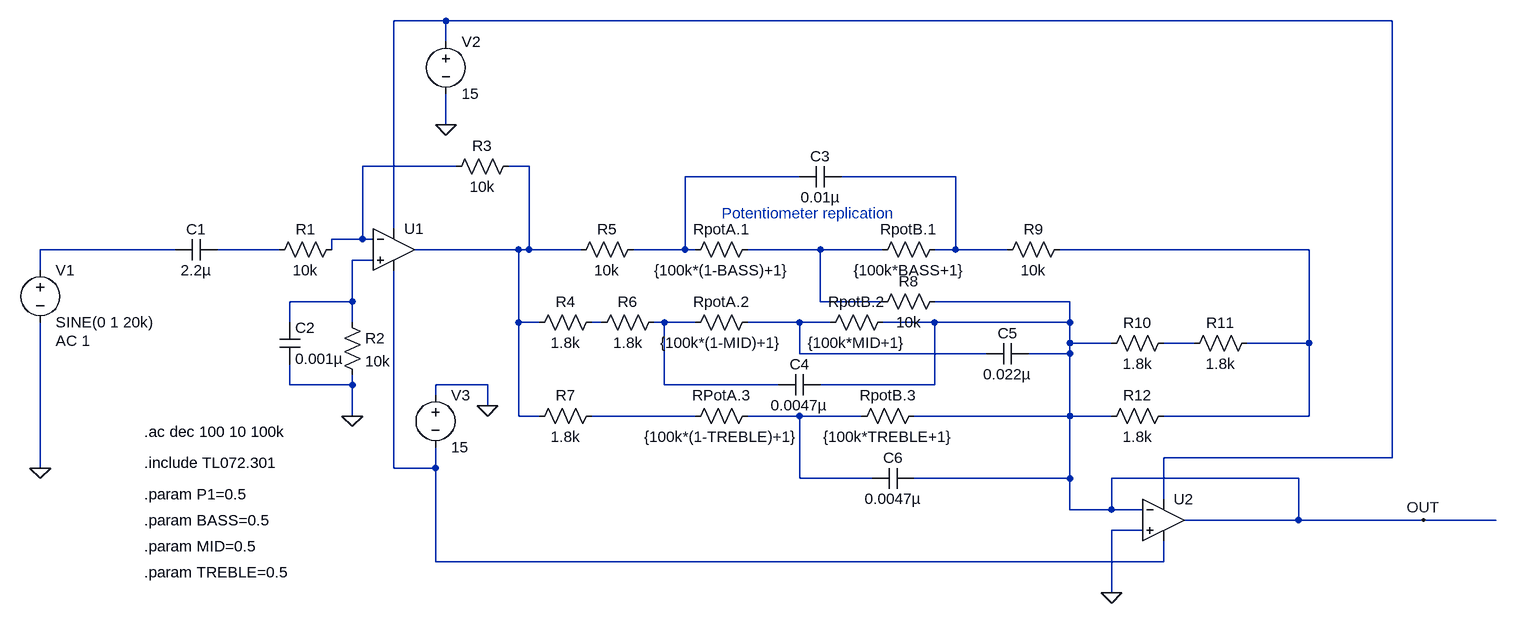
[diagram p0: schematic Draft1.asc]
Draft1.asc, the LTspice schematic file:
Version 4.1
SHEET 1 2372 772
WIRE 752 -272 672 -272
WIRE 2208 -272 752 -272
WIRE 752 -240 752 -272
WIRE 752 -112 752 -160
WIRE 768 -48 624 -48
WIRE 880 -48 848 -48
WIRE 1296 -32 1120 -32
WIRE 1536 -32 1360 -32
WIRE 672 48 672 -272
WIRE 624 64 624 -48
WIRE 624 64 576 64
WIRE 640 64 624 64
WIRE 336 80 128 80
WIRE 496 80 400 80
WIRE 576 80 576 64
WIRE 864 80 704 80
WIRE 880 80 880 -48
WIRE 880 80 864 80
WIRE 960 80 880 80
WIRE 1120 80 1120 -32
WIRE 1120 80 1040 80
WIRE 1136 80 1120 80
WIRE 1328 80 1216 80
WIRE 1424 80 1328 80
WIRE 1536 80 1536 -32
WIRE 1536 80 1504 80
WIRE 1616 80 1536 80
WIRE 2080 80 1696 80
WIRE 640 96 608 96
WIRE 128 112 128 80
WIRE 608 160 608 96
WIRE 608 160 512 160
WIRE 1328 160 1328 80
WIRE 1424 160 1328 160
WIRE 1712 160 1504 160
WIRE 512 192 512 160
WIRE 608 192 608 160
WIRE 864 192 864 80
WIRE 896 192 864 192
WIRE 992 192 976 192
WIRE 1088 192 1072 192
WIRE 1136 192 1088 192
WIRE 1296 192 1216 192
WIRE 1344 192 1296 192
WIRE 1504 192 1424 192
WIRE 1712 192 1712 160
WIRE 1712 192 1504 192
WIRE 1712 224 1712 192
WIRE 1776 224 1712 224
WIRE 1904 224 1856 224
WIRE 2080 224 2080 80
WIRE 2080 224 1984 224
WIRE 1296 240 1296 192
WIRE 1584 240 1296 240
WIRE 1712 240 1712 224
WIRE 1712 240 1648 240
WIRE 512 288 512 256
WIRE 608 288 608 272
WIRE 608 288 512 288
WIRE 816 288 736 288
WIRE 1088 288 1088 192
WIRE 1264 288 1088 288
WIRE 1504 288 1504 192
WIRE 1504 288 1328 288
WIRE 736 304 736 288
WIRE 816 320 816 288
WIRE 608 336 608 288
WIRE 864 336 864 192
WIRE 896 336 864 336
WIRE 1136 336 976 336
WIRE 1296 336 1216 336
WIRE 1392 336 1296 336
WIRE 1712 336 1712 240
WIRE 1712 336 1472 336
WIRE 1776 336 1712 336
WIRE 2080 336 2080 224
WIRE 2080 336 1856 336
WIRE 2208 400 2208 -272
WIRE 2208 400 1856 400
WIRE 128 416 128 192
WIRE 672 416 672 112
WIRE 736 416 736 384
WIRE 736 416 672 416
WIRE 1296 432 1296 336
WIRE 1408 432 1296 432
WIRE 1712 432 1712 336
WIRE 1712 432 1472 432
WIRE 2064 432 1776 432
WIRE 1856 464 1856 400
WIRE 1712 480 1712 432
WIRE 1776 480 1776 432
WIRE 1776 480 1712 480
WIRE 1824 480 1776 480
WIRE 2064 496 2064 432
WIRE 2064 496 1888 496
WIRE 2256 496 2064 496
WIRE 2368 496 2256 496
WIRE 1824 512 1776 512
WIRE 736 560 736 416
WIRE 1856 560 1856 528
WIRE 1856 560 736 560
WIRE 1776 608 1776 512
FLAG 752 -112 0
FLAG 608 336 0
FLAG 816 320 0
FLAG 128 416 0
FLAG 1776 608 0
FLAG 2256 496 OUT
SYMBOL voltage 128 96 R0
WINDOW 123 24 124 Left 2
WINDOW 39 0 0 Left 0
SYMATTR InstName V1
SYMATTR Value SINE(0 1 20k)
SYMATTR Value2 AC 1
SYMBOL cap 400 64 R90
WINDOW 0 0 32 VBottom 2
WINDOW 3 32 32 VTop 2
SYMATTR InstName C1
SYMATTR Value 2.2µ
SYMBOL res 592 64 R90
WINDOW 0 0 56 VBottom 2
WINDOW 3 32 56 VTop 2
SYMATTR InstName R1
SYMATTR Value 10k
SYMBOL voltage 752 -256 R0
WINDOW 123 0 0 Left 0
WINDOW 39 0 0 Left 0
SYMATTR InstName V2
SYMATTR Value 15
SYMBOL res 864 -64 R90
WINDOW 0 0 56 VBottom 2
WINDOW 3 32 56 VTop 2
SYMATTR InstName R3
SYMATTR Value 10k
SYMBOL res 592 176 R0
SYMATTR InstName R2
SYMATTR Value 10k
SYMBOL cap 496 192 R0
SYMATTR InstName C2
SYMATTR Value 0.001µ
SYMBOL voltage 736 288 R0
WINDOW 123 0 0 Left 0
WINDOW 39 0 0 Left 0
SYMATTR InstName V3
SYMATTR Value 15
SYMBOL res 1056 64 R90
WINDOW 0 0 56 VBottom 2
WINDOW 3 32 56 VTop 2
SYMATTR InstName R5
SYMATTR Value 10k
SYMBOL res 992 176 R90
WINDOW 0 0 56 VBottom 2
WINDOW 3 32 56 VTop 2
SYMATTR InstName R4
SYMATTR Value 1.8k
SYMBOL res 1088 176 R90
WINDOW 0 0 56 VBottom 2
WINDOW 3 32 56 VTop 2
SYMATTR InstName R6
SYMATTR Value 1.8k
SYMBOL res 992 320 R90
WINDOW 0 0 56 VBottom 2
WINDOW 3 32 56 VTop 2
SYMATTR InstName R7
SYMATTR Value 1.8k
SYMBOL res 1232 64 R90
WINDOW 0 0 56 VBottom 2
WINDOW 3 32 56 VTop 2
SYMATTR InstName RpotA.1
SYMATTR Value {100k*(1-BASS)+1}
SYMBOL res 1520 64 R90
WINDOW 0 0 56 VBottom 2
WINDOW 3 32 56 VTop 2
SYMATTR InstName RpotB.1
SYMATTR Value {100k*BASS+1}
SYMBOL cap 1360 -48 R90
WINDOW 0 0 32 VBottom 2
WINDOW 3 32 32 VTop 2
SYMATTR InstName C3
SYMATTR Value 0.01µ
SYMBOL res 1520 144 R90
WINDOW 0 0 56 VBottom 2
WINDOW 3 32 56 VTop 2
SYMATTR InstName R8
SYMATTR Value 10k
SYMBOL res 1712 64 R90
WINDOW 0 0 56 VBottom 2
WINDOW 3 32 56 VTop 2
SYMATTR InstName R9
SYMATTR Value 10k
SYMBOL res 1232 176 R90
WINDOW 0 0 56 VBottom 2
WINDOW 3 32 56 VTop 2
SYMATTR InstName RpotA.2
SYMATTR Value {100k*(1-MID)+1}
SYMBOL res 1440 176 R90
WINDOW 0 0 56 VBottom 2
WINDOW 3 32 56 VTop 2
SYMATTR InstName RpotB.2
SYMATTR Value {100k*MID+1}
SYMBOL cap 1328 272 R90
WINDOW 0 0 32 VBottom 2
WINDOW 3 32 32 VTop 2
SYMATTR InstName C4
SYMATTR Value 0.0047µ
SYMBOL cap 1648 224 R90
WINDOW 0 0 32 VBottom 2
WINDOW 3 32 32 VTop 2
SYMATTR InstName C5
SYMATTR Value 0.022µ
SYMBOL res 1232 320 R90
WINDOW 0 0 56 VBottom 2
WINDOW 3 32 56 VTop 2
SYMATTR InstName RPotA.3
SYMATTR Value {100k*(1-TREBLE)+1}
SYMBOL res 1488 320 R90
WINDOW 0 0 56 VBottom 2
WINDOW 3 32 56 VTop 2
SYMATTR InstName RpotB.3
SYMATTR Value {100k*TREBLE+1}
SYMBOL cap 1472 416 R90
WINDOW 0 0 32 VBottom 2
WINDOW 3 32 32 VTop 2
SYMATTR InstName C6
SYMATTR Value 0.0047µ
SYMBOL res 1872 208 R90
WINDOW 0 0 56 VBottom 2
WINDOW 3 32 56 VTop 2
SYMATTR InstName R10
SYMATTR Value 1.8k
SYMBOL res 2000 208 R90
WINDOW 0 0 56 VBottom 2
WINDOW 3 32 56 VTop 2
SYMATTR InstName R11
SYMATTR Value 1.8k
SYMBOL res 1872 320 R90
WINDOW 0 0 56 VBottom 2
WINDOW 3 32 56 VTop 2
SYMATTR InstName R12
SYMATTR Value 1.8k
SYMBOL OpAmps\\UniversalOpAmp2 1856 496 R0
SYMATTR InstName U2
SYMBOL OpAmps\\UniversalOpAmp2 672 80 R0
SYMATTR InstName U1
TEXT 288 408 Left 2 !.include TL072.301
TEXT 288 360 Left 2 !.ac dec 100 10 100k
TEXT 288 456 Left 2 !.param P1=0.5
TEXT 1176 24 Left 2 ;Potentiometer replication
TEXT 288 496 Left 2 !.param BASS=0.5
TEXT 288 536 Left 2 !.param MID=0.5
TEXT 288 576 Left 2 !.param TREBLE=0.5

The netlist it stands for:
* Draft1.asc
V1 N006 0 SINE(0 1 20k) AC 1
C1 N007 N006 2.2µ
R1 N002 N007 10k
V2 N001 0 15
R3 N003 N002 10k
R2 N010 0 10k
C2 N010 0 0.001µ
V3 0 N017 15
R5 N004 N003 10k
R4 N011 N003 1.8k
R6 N012 N011 1.8k
R7 N015 N003 1.8k
RpotA.1 N008 N004 {100k*(1-BASS)+1}
RpotB.1 N005 N008 {100k*BASS+1}
C3 N005 N004 0.01µ
R8 OUT N008 10k
R9 N009 N005 10k
RpotA.2 N013 N012 {100k*(1-MID)+1}
RpotB.2 OUT N013 {100k*MID+1}
C4 OUT N012 0.0047µ
C5 OUT N013 0.022µ
RPotA.3 N016 N015 {100k*(1-TREBLE)+1}
RpotB.3 OUT N016 {100k*TREBLE+1}
C6 OUT N016 0.0047µ
R10 N014 OUT 1.8k
R11 N009 N014 1.8k
R12 N009 OUT 1.8k
X§U2 0 OUT N001 N017 OUT level2 Avol=1Meg GBW=10Meg Slew=10Meg Ilimit=25m Rail=0 Vos=0 En=0 Enk=0 In=0 Ink=0 Rin=500Meg  ; pins In+ In- V+ V- OUT
X§U1 N010 N002 N001 N017 N003 level2 Avol=1Meg GBW=10Meg Slew=10Meg Ilimit=25m Rail=0 Vos=0 En=0 Enk=0 In=0 Ink=0 Rin=500Meg  ; pins In+ In- V+ V- OUT
.include TL072.301
.ac dec 100 10 100k
.param P1=0.5
* Potentiometer replication
.param BASS=0.5
.param MID=0.5
.param TREBLE=0.5
.lib UniversalOpAmp2.lib
.backanno
.end